# Altium schematic sheet VCA.SchDoc
size B; SheetNumber: 1; SheetTotal: 1
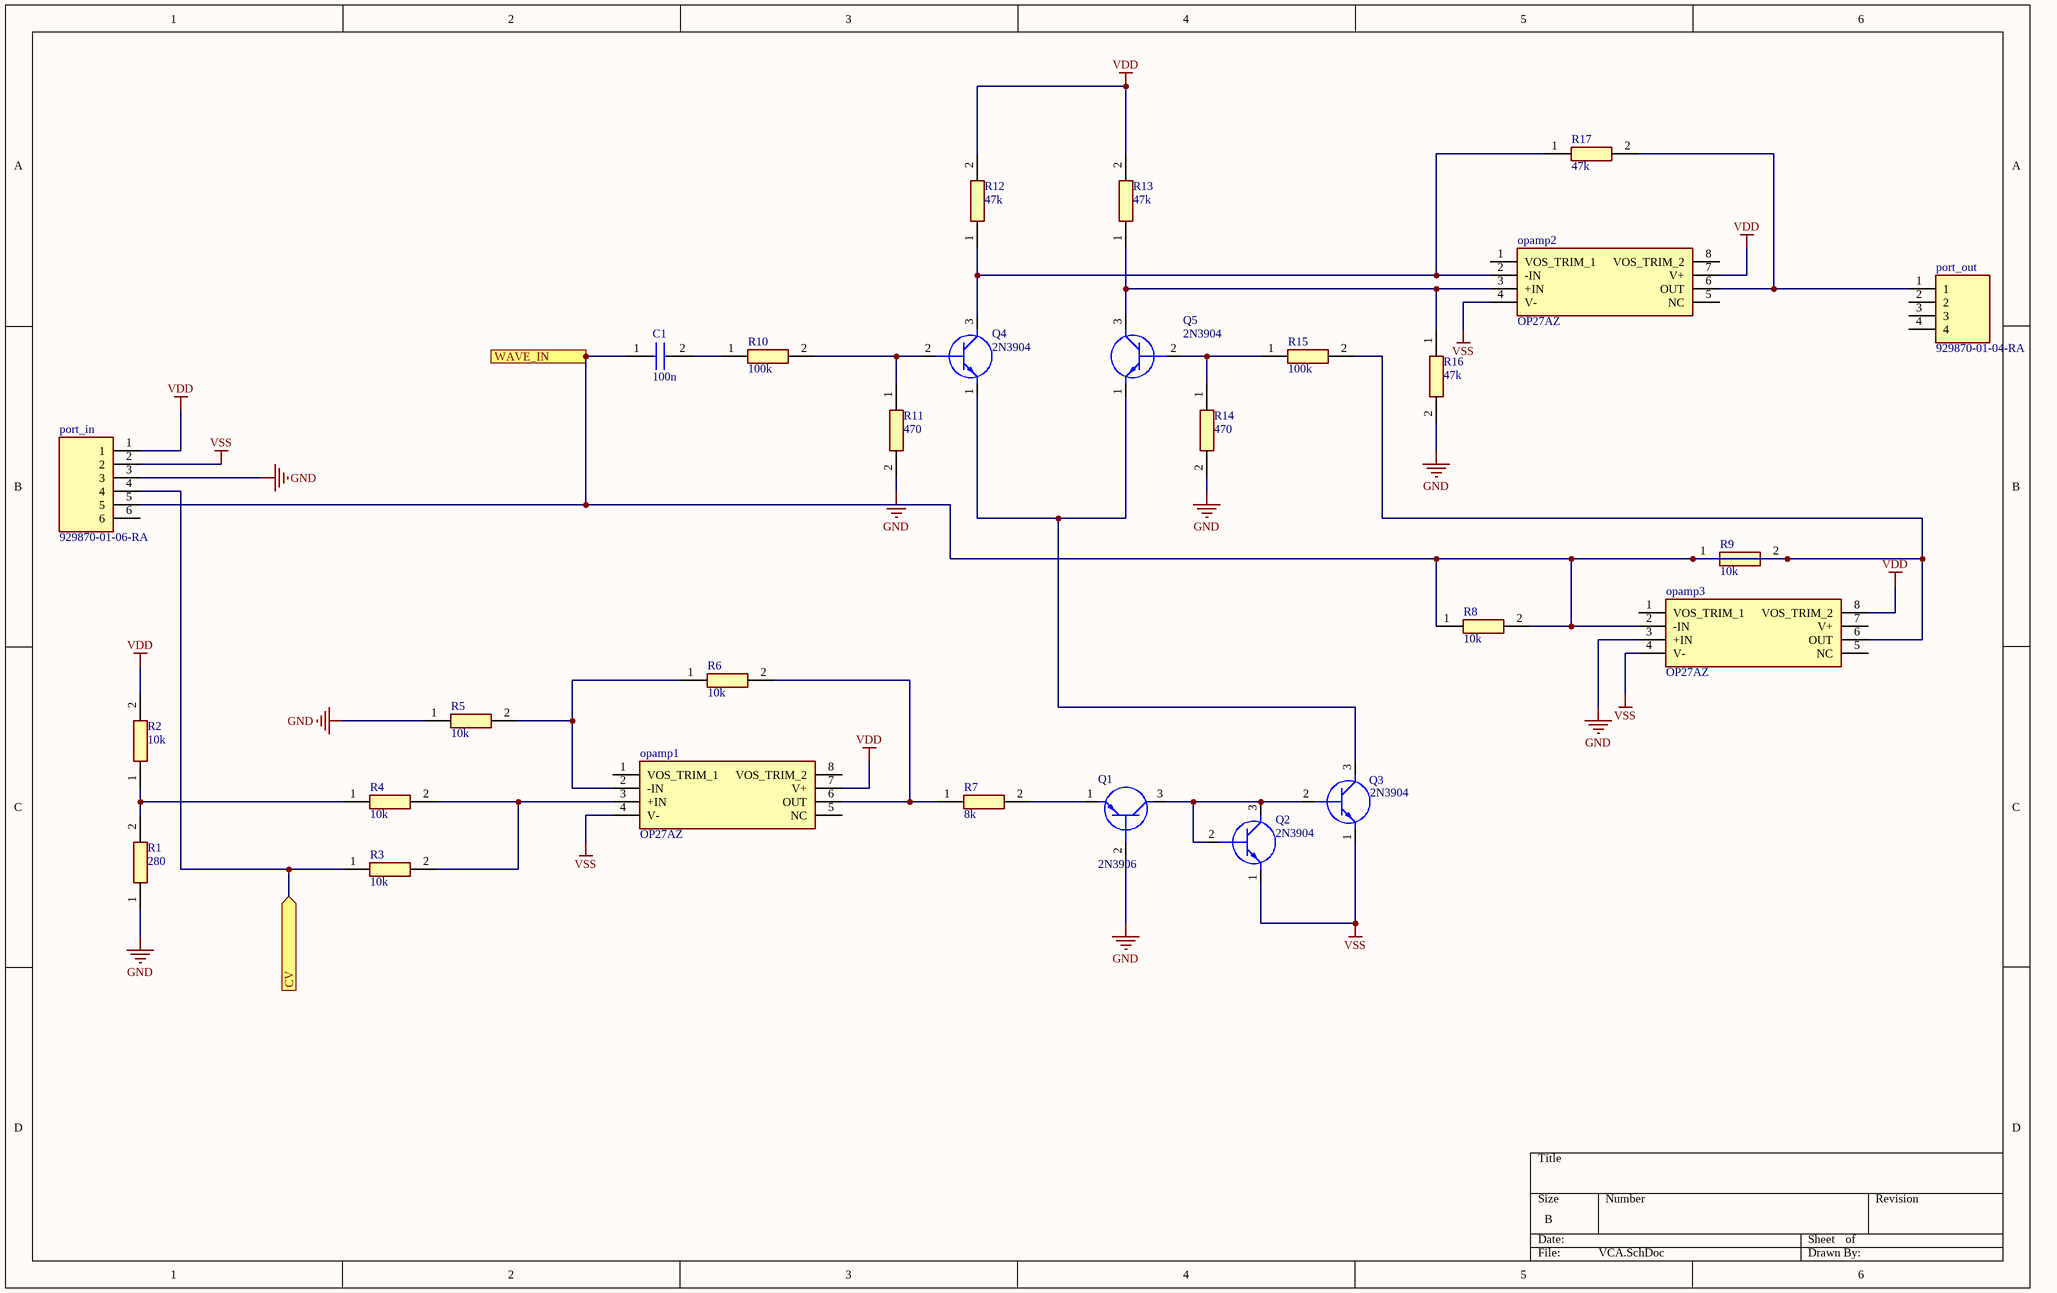
[diagram p0: VCA.SchDoc]

## Parts
C1  100n  [CAPPA2400W30L800D400]
opamp1  OP27AZ  [DIP775W58P254L1029H508Q8N]
opamp2  OP27AZ  [DIP775W58P254L1029H508Q8N]
opamp3  OP27AZ  [DIP775W58P254L1029H508Q8N]
port_in  929870-01-06-RA  [RHDR6W64P0X254_1X6_1524X254X380P]
port_out  929870-01-04-RA  [RHDR4W76P0X254_1X4_1016X254X826P]
Q1  2N3906  [2N5457]
Q2  2N3904  [CS_TO-92]
Q3  2N3904  [CS_TO-92]
Q4  2N3904  [CS_TO-92]
Q5  2N3904  [CS_TO-92]
R1  280  [RESAD1650W60L650D250]
R2  10k  [RESAD1650W60L650D250]
R3  10k  [RESAD1650W60L650D250]
R4  10k  [RESAD1650W60L650D250]
R5  10k  [RESAD1650W60L650D250]
R6  10k  [RESAD1650W60L650D250]
R7  8k  [RESAD1650W60L650D250]
R8  10k  [RESAD1650W60L650D250]
R9  10k  [RESAD1650W60L650D250]
R10  100k  [RESAD1650W60L650D250]
R11  470  [RESAD1650W60L650D250]
R12  47k  [RESAD1650W60L650D250]
R13  47k  [RESAD1650W60L650D250]
R14  470  [RESAD1650W60L650D250]
R15  100k  [RESAD1650W60L650D250]
R16  47k  [RESAD1650W60L650D250]
R17  47k  [RESAD1650W60L650D250]

## Ports
CV (in), WAVE_IN (in)

## Nets
GND: opamp3.3(+IN) port_in.3 Q1.2(B) R1.1 R5.1 R11.2 R14.2 R16.2
VDD: opamp1.7(V+) opamp2.7(V+) opamp3.8(VOS_TRIM_2) port_in.1 R2.2 R12.2 R13.2
VSS: opamp1.4(V-) opamp2.4(V-) opamp3.4(V-) port_in.2 Q2.1(E) Q3.1(E)
CV: port_in.4 R3.1 ; port CV
WAVE_IN: C1.1(+) opamp3.2(-IN) opamp3.6(OUT) port_in.5 R8.1 R8.2 R9.1 R9.2 R15.2 ; port WAVE_IN
NetC1_2: C1.2(-) R10.1
Netopamp1_2: opamp1.2(-IN) R5.2 R6.1
Netopamp1_3: opamp1.3(+IN) R3.2 R4.2
Netopamp1_6: opamp1.6(OUT) R6.2 R7.1
Netopamp2_2: opamp2.2(-IN) Q4.3(C) R12.1 R17.1
Netopamp2_3: opamp2.3(+IN) Q5.3(C) R13.1 R16.1
Netopamp2_6: opamp2.6(OUT) port_out.1 R17.2
NetQ1_1: Q1.1(E) R7.2
NetQ1_3: Q1.3(C) Q2.2(B) Q2.3(C) Q3.2(B)
NetQ3_3: Q3.3(C) Q4.1(E) Q5.1(E)
NetQ4_2: Q4.2(B) R10.2 R11.1
NetQ5_2: Q5.2(B) R14.1 R15.1
NetR1_2: R1.2 R2.1 R4.1

Not connected (* = marked no-connect by the designer): opamp1 1(VOS_TRIM_1) 5(NC) 8(VOS_TRIM_2); opamp2 1(VOS_TRIM_1) 5(NC) 8(VOS_TRIM_2); opamp3 1(VOS_TRIM_1) 5(NC) 7(V+); port_in 6; port_out 2 3 4

## Library data of the parts
C1 = 0113207: Capacitor; Manufacturer_Name: RS Pro; Datasheet Link: https://docs.rs-online.com/d68c/0900766b8157e121.pdf; Manufacturer_Part_Number: 0113207
opamp1-opamp3 = OP27AZ: Integrated Circuit; Manufacturer_Name: Analog Devices; Datasheet Link: https://www.analog.com/media/en/technical-documentation/data-sheets/OP27.pdf; Height: 5.08mm; Manufacturer_Part_Number: OP27AZ; Mouser Part Number: 700-OP27AZNR; Mouser Price/Stock: https://www.mouser.co.uk/ProductDetail/Maxim-Integrated/OP27AZ?qs=7RslVrYcaDTFV9h3XrpsTA%3D%3D; Arrow Part Number: OP27AZ; Arrow Price/Stock: https://www.arrow.com/en/products/op27az/analog-devices
port_in = 929870-01-06-RA: Connector; Manufacturer_Name: 3M; Datasheet Link: https://componentsearchengine.com/Datasheets/1/929870-01-06-RA.pdf; Height: 3.8mm; Manufacturer_Part_Number: 929870-01-06-RA; Mouser Part Number: 517-929870-01-06-RA; Mouser Price/Stock: https://www.mouser.co.uk/ProductDetail/3M-Electronic-Solutions-Division/929870-01-06-RA?qs=neFkstNq%252B6F6Q7pF8hOFFA%3D%3D; Arrow Part Number: 929870-01-06-RA; Arrow Price/Stock: https://www.arrow.com/en/products/929870-01-06-ra/3m?region=nac
port_out = 929870-01-04-RA: Connector; Manufacturer_Name: 3M; Datasheet Link: https://componentsearchengine.com/Datasheets/2/929870-01-04-RA.pdf; Height: 8.26mm; Manufacturer_Part_Number: 929870-01-04-RA; Mouser Part Number: 517-929870-01-04-RA; Mouser Price/Stock: https://www.mouser.co.uk/ProductDetail/3M-Electronic-Solutions-Division/929870-01-04-RA?qs=neFkstNq%252B6GPZEKactAgTg%3D%3D; Arrow Part Number: 929870-01-04-RA; Arrow Price/Stock: https://www.arrow.com/en/products/929870-01-04-ra/3m
Q1 = 2N3906: Transistor BJT PNP; Manufacturer_Name: Central Semiconductor; Datasheet Link: http://www.mouser.com/datasheet/2/68/2n3905-29545.pdf; Height: 5.33mm; Manufacturer_Part_Number: 2N3906; Mouser Part Number: 610-2N3906; Mouser Price/Stock: https://www.mouser.com/Search/Refine.aspx?Keyword=610-2N3906; Arrow Part Number: 2N3906; Arrow Price/Stock: https://www.arrow.com/en/products/2n3906/central-semiconductor?region=nac
Q2-Q5 = 2N3904: Transistor BJT NPN; Manufacturer_Name: Central Semiconductor; Datasheet Link: https://my.centralsemi.com/get_document.php?cmp=1&mergetype=pd&mergepath=pd&pdf_id=2N3903.PDF; Manufacturer_Part_Number: 2N3904; Mouser Part Number: 610-2N3904; Mouser Price/Stock: https://www.mouser.com/Search/Refine.aspx?Keyword=610-2N3904
R1-R17 = MRS25000C1003FC100: Resistor; Manufacturer_Name: Vishay; Datasheet Link: http://www.vishay.com/docs/28724/mrs16m25.pdf; Manufacturer_Part_Number: MRS25000C1003FC100; Mouser Part Number: 594-MRS25000C1003FC1; Mouser Price/Stock: https://www.mouser.co.uk/ProductDetail/Vishay-BC-Components/MRS25000C1003FC100?qs=H30XFsNYD%2FHyk6mBpuomxg%3D%3D; Arrow Part Number: MRS25000C1003FC100; Arrow Price/Stock: https://www.arrow.com/en/products/mrs25000c1003fc100/vishay?region=nac